# EAGLE schematic PIC32-HMZ144_Rev_B (EAGLE 4.16)
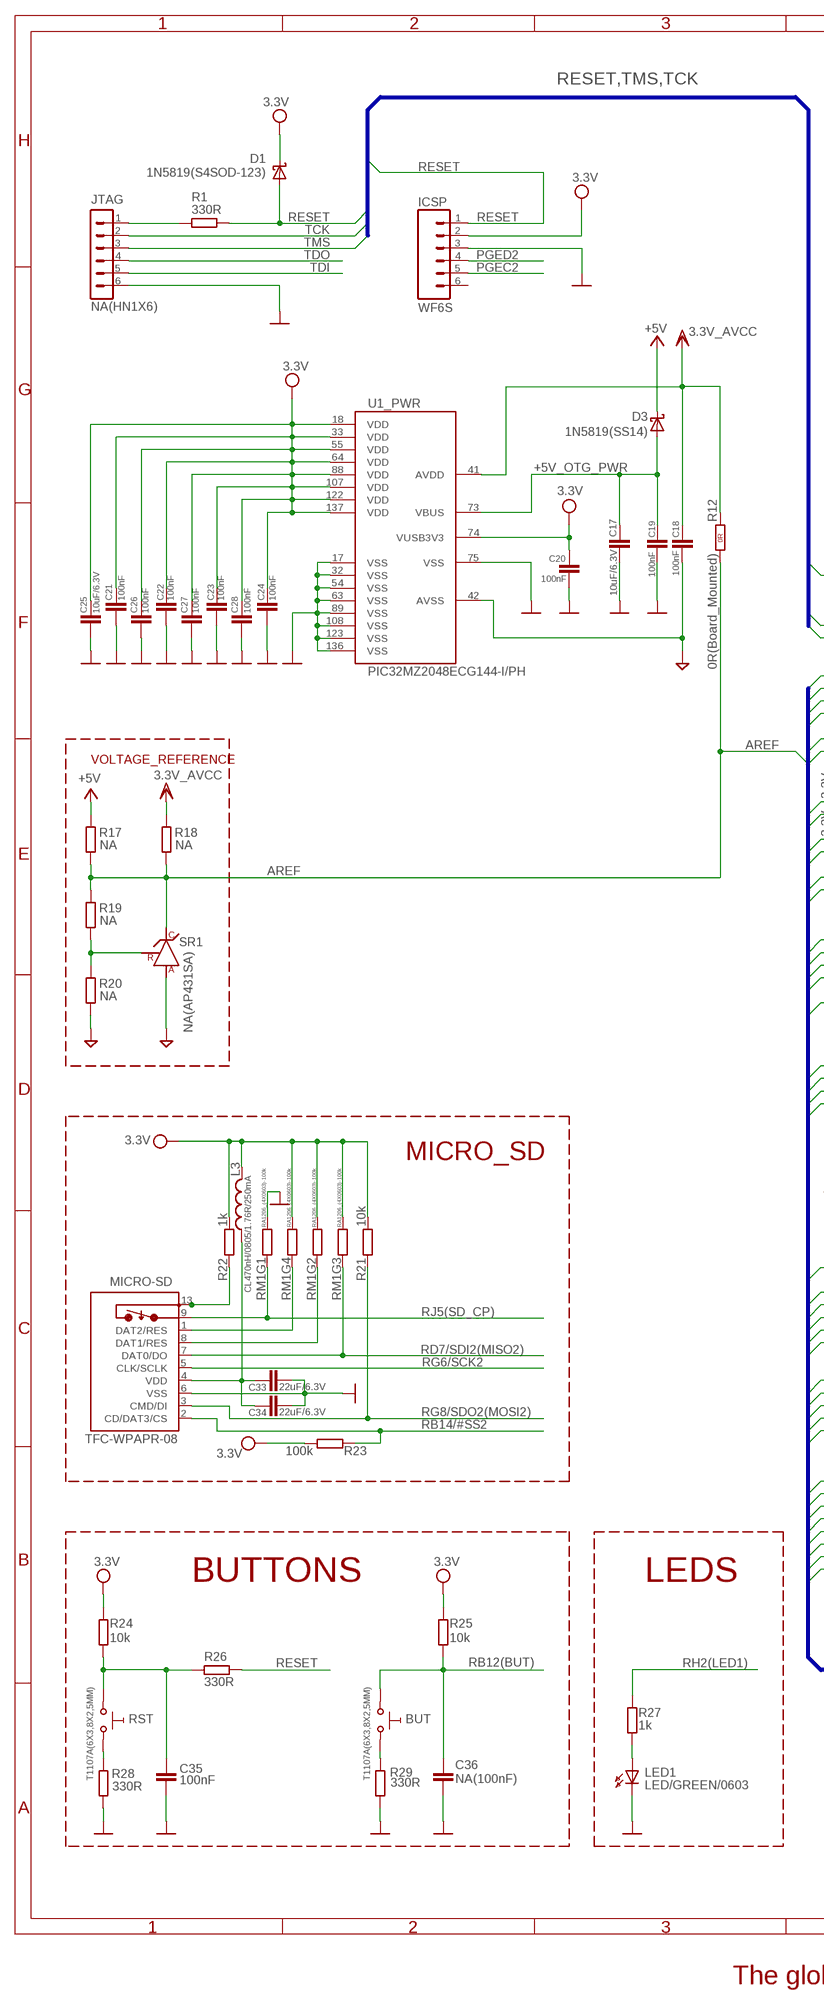
[diagram p0: schematic, sheet 1, part 1 of 2]
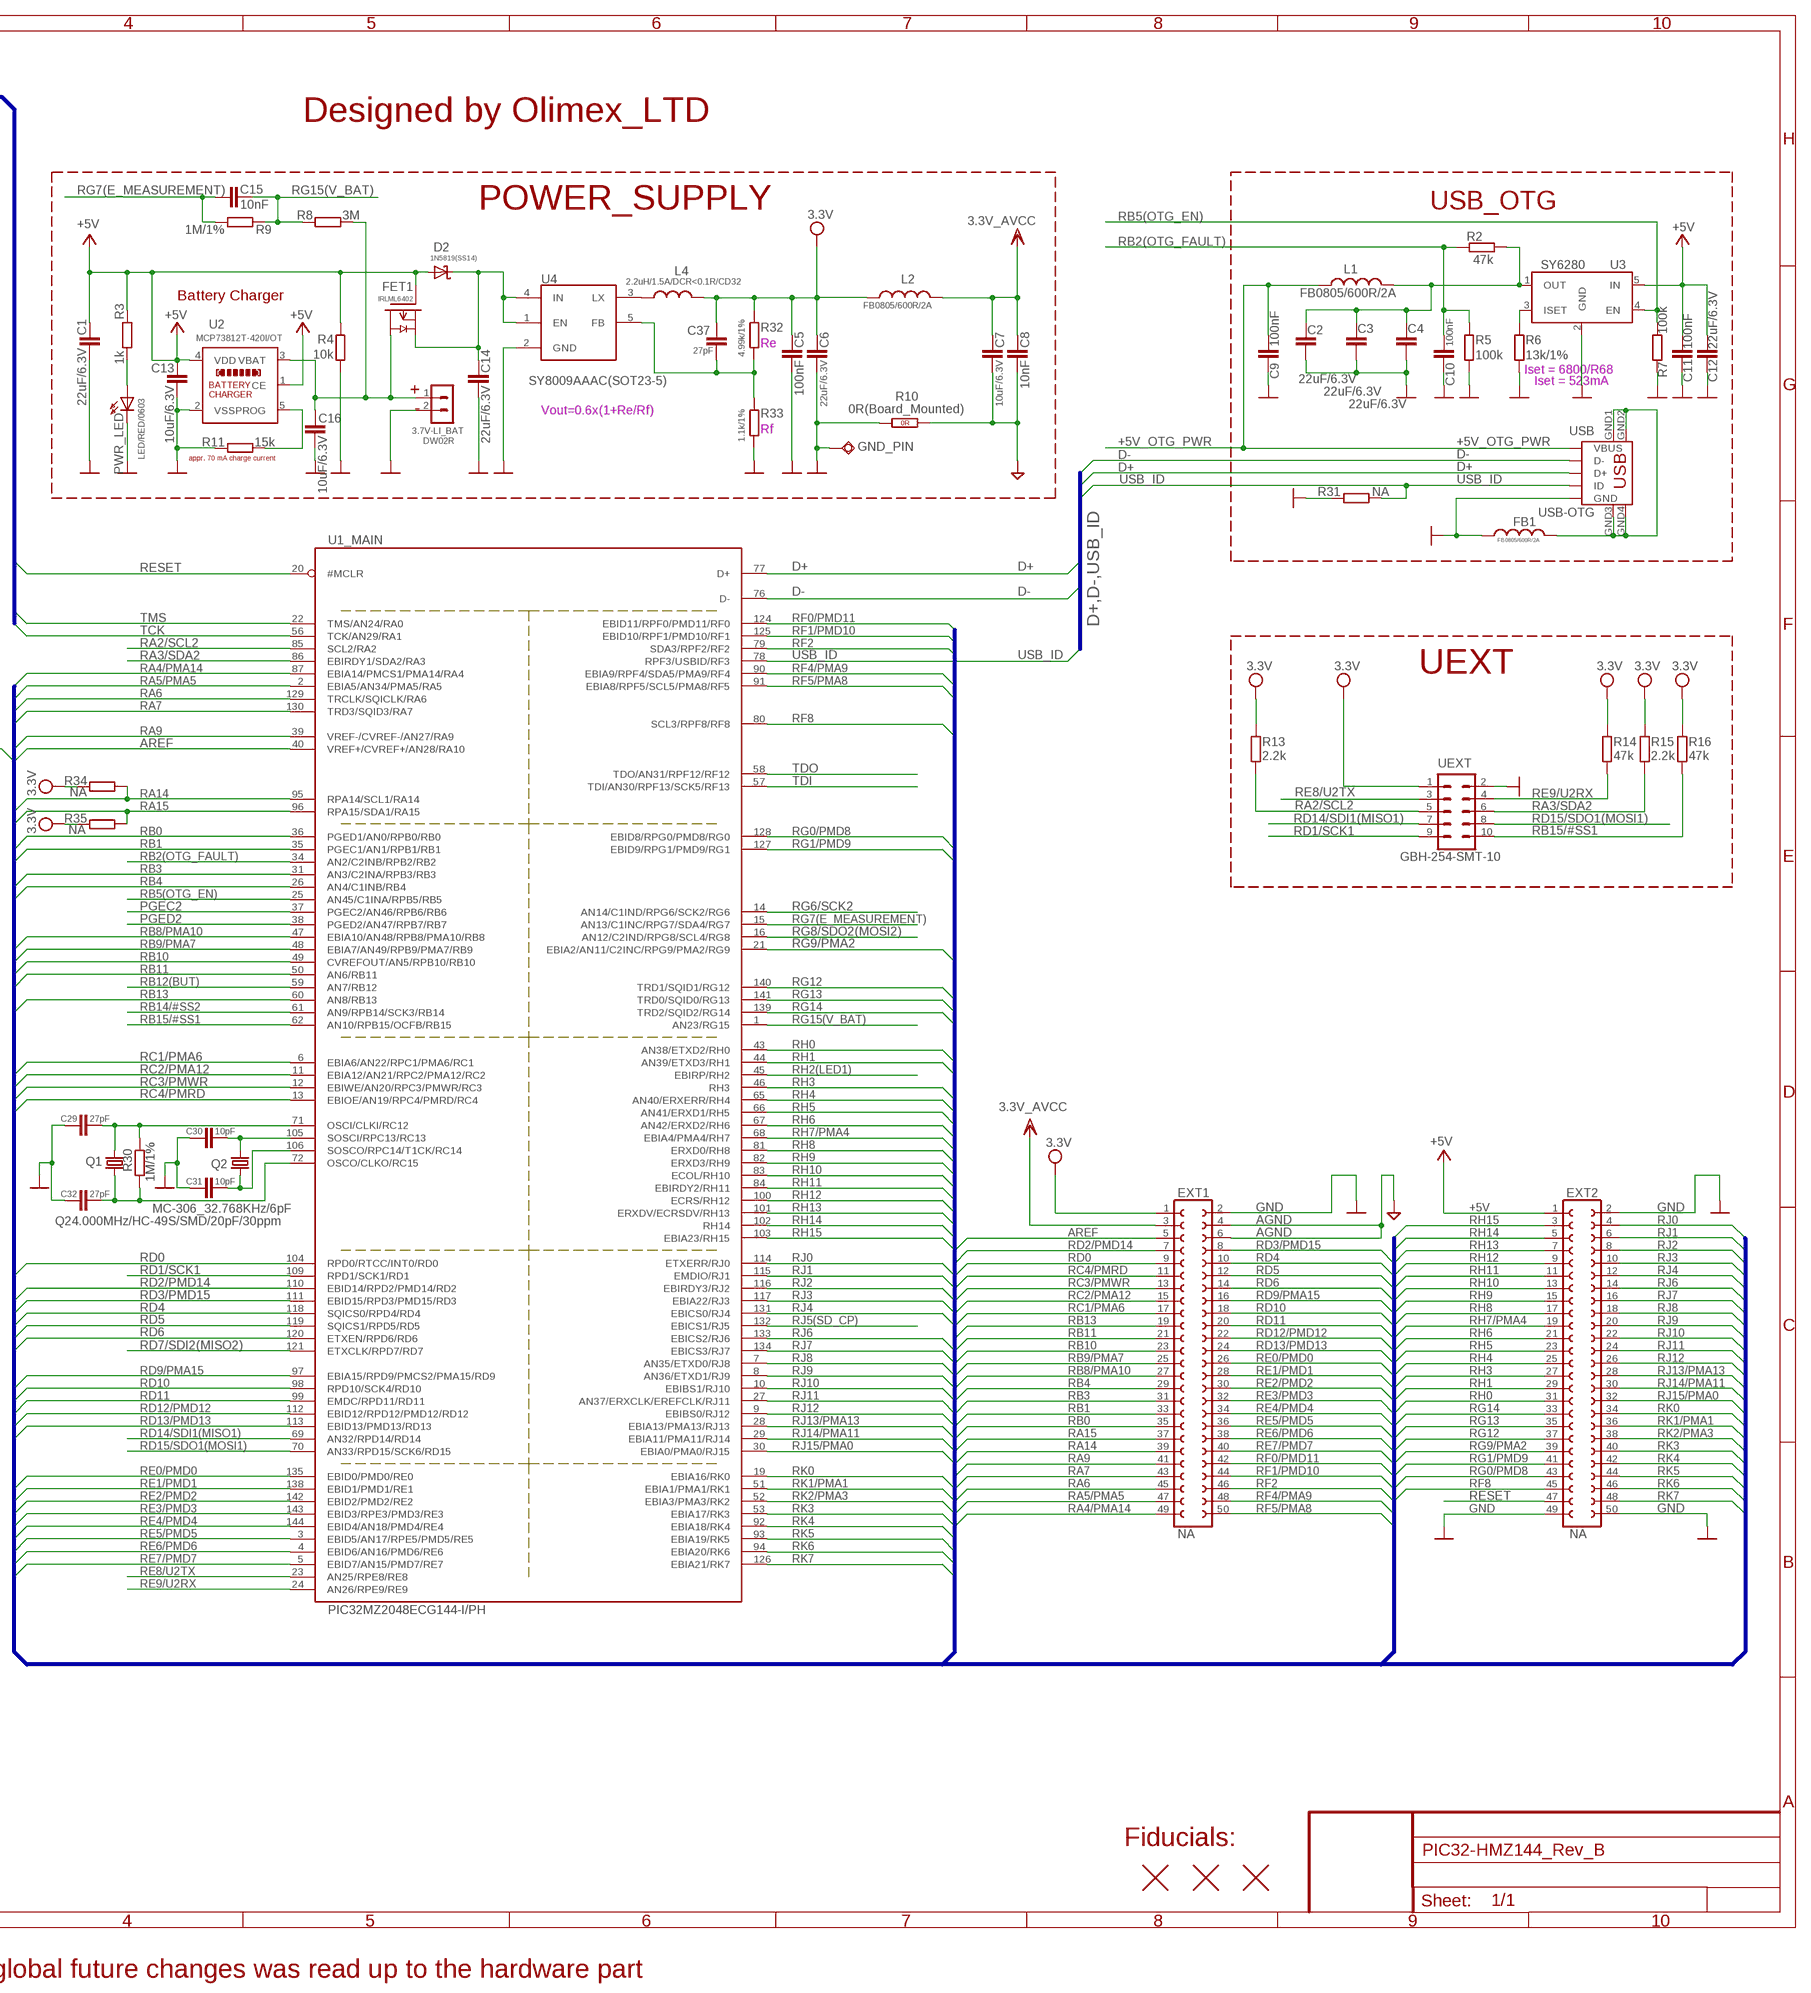
[diagram p1: schematic, sheet 1, part 2 of 2]

## Parts
3.7V-LI_BAT  DW02R  CON2DW02R  [DW02R]
BUT  T1107A(6X3,8X2,5MM)  SW-TAKTT1107A(6X3,8X2,5MM)  [WS-TAKT_6X3.5_SMD_NOCREAM]
C1  22uF/6.3V  C-EUC0603  [C0603]
C2  22uF/6.3V  C-EUC0603  [C0603]
C3  22uF/6.3V  C-EUC0603  [C0603]
C4  22uF/6.3V  C-EUC0603  [C0603]
C5  100nF  C-EUC0603  [C0603]
C6  22uF/6.3V  C-EUC0603  [C0603]
C7  10uF/6.3V  C-EUC0603  [C0603]
C8  10nF  C-EUC0603  [C0603]
C9  100nF  C-EUC0603  [C0603]
C10  100nF  C-EUC0603  [C0603]
C11  100nF  C-EUC0603  [C0603]
C12  22uF/6.3V  C-EUC0603  [C0603]
C13  10uF/6.3V  C-EUC0603  [C0603]
C14  22uF/6.3V  C-EUC0603  [C0603]
C15  10nF  C-EUC0603  [C0603]
C16  10uF/6.3V  C-EUC0603  [C0603]
C17  10uF/6.3V  C-EUC0603  [C0603]
C18  100nF  C-EUC0603  [C0603]
C19  100nF  C-EUC0603  [C0603]
C20  100nF  C-EUC0603  [C0603]
C21  100nF  C-EUC0603  [C0603]
C22  100nF  C-EUC0603  [C0603]
C23  100nF  C-EUC0603  [C0603]
C24  100nF  C-EUC0603  [C0603]
C25  10uF/6.3V  C-EUC0603  [C0603]
C26  100nF  C-EUC0603  [C0603]
C27  100nF  C-EUC0603  [C0603]
C28  100nF  C-EUC0603  [C0603]
C29  27pF  C-EUC0603  [C0603]
C30  10pF  C-EUC0603  [C0603]
C31  10pF  C-EUC0603  [C0603]
C32  27pF  C-EUC0603  [C0603]
C33  22uF/6.3V  C-EUC0603  [C0603]
C34  22uF/6.3V  C-EUC0603  [C0603]
C35  100nF  C-EUC0603  [C0603]
C36  NA(100nF)  C-EUC0603  [C0603]
C37  27pF  C-EUC0603  [C0603]
D1  1N5819(S4SOD-123)  SCHOTKKY7.62SS-1N5819(S4SOD-123)  [SOD-123]
D2  1N5819(SS14)  SCHOTKKY7.62SS2  [MLL-41]
D3  1N5819(SS14)  SCHOTKKY7.62SS2  [MLL-41]
EXT1  NA  FE25-2FEMALE  [FE25-2]
EXT2  NA  FE25-2FEMALE  [FE25-2]
FB1  FB0805/600R/2A  L-USL0805_5MIL_DWS  [L0805_5MIL_DWS]
FET1  IRLML6402  [SOT23]
GND_PIN  TESTPAD3  [TEST_PAD40/70/SQUARE]
ICSP  WF6S  CON62.54-0-D  [CON2.54MM-6-0D]
JTAG  NA(HN1X6)  CON6HN1X6  [HN1X6]
L1  FB0805/600R/2A  L-USL0805_5MIL_DWS  [L0805_5MIL_DWS]
L2  FB0805/600R/2A  L-USL0805_5MIL_DWS  [L0805_5MIL_DWS]
L3  CL470nH/0805/1.76R/250mA  L-USL0805  [L0805]
L4  2.2uH/1.5A/DCR<0.1R/CD32  L-CD32  [CD32]
LED1  LED/GREEN/0603  LED0603DWS  [LED-0603]
MICRO-SD  TFC-WPAPR-08  MICRO_SD/MMC_CP_NEWTFC-WPAPR-08  [TFC-WPAPR-08]
PWR_LED  LED/RED/0603  LED0603DWS  [LED-0603]
Q1  Q24.000MHz/HC-49S/SMD/20pF/30ppm  HC49/SHC49/SMD_THIN&SHORT  [HC49/SMD2_THIN&SHORT]
Q2  MC-306_32.768KHz/6pF  MC-306_32.768KHZ/SMD_8038  [MC-306]
R1  330R  R-EU_R0603  [R0603]
R2  47k  R-EU_R0603  [R0603]
R3  1k  R-EU_R0603  [R0603]
R4  10k  R-EU_R0603  [R0603]
R5  100k  R-EU_R0603  [R0603]
R6  13k/1%  R-EU_R0603  [R0603]
R7  100k  R-EU_R0603  [R0603]
R8  3M  R-EU_R0603  [R0603]
R9  1M/1%  R-EU_R0603  [R0603]
R10  0R(Board_Mounted)  R_0R0R(NA)  [0603_0R]
R11  15k  R-EU_R0603  [R0603]
R12  0R(Board_Mounted)  R_0R0R(NA)  [0603_0R]
R13  2.2k  R-EU_R0603  [R0603]
R14  47k  R-EU_R0603  [R0603]
R15  2.2k  R-EU_R0603  [R0603]
R16  47k  R-EU_R0603  [R0603]
R17  NA  R-EU_R0603  [R0603]
R18  NA  R-EU_R0603  [R0603]
R19  NA  R-EU_R0603  [R0603]
R20  NA  R-EU_R0603  [R0603]
R21  10k  R-EU_R0603  [R0603]
R22  1k  R-EU_R0603  [R0603]
R23  100k  R-EU_R0603  [R0603]
R24  10k  R-EU_R0603  [R0603]
R25  10k  R-EU_R0603  [R0603]
R26  330R  R-EU_R0603  [R0603]
R27  1k  R-EU_R0603  [R0603]
R28  330R  R-EU_R0603  [R0603]
R29  330R  R-EU_R0603  [R0603]
R30  1M/1%  R-EU_R0603  [R0603]
R31  NA  R-EU_R0603  [R0603]
R32  4.99k/1%  R-EU_R0603_5MIL_DWS  [R0603_5MIL_DWS]
R33  1.1k/1%  R-EU_R0603_5MIL_DWS  [R0603_5MIL_DWS]
R34  NA  R-EU_R0603  [R0603]
R35  NA  R-EU_R0603  [R0603]
RM1  RA1206_(4X0603)-100k  R_MATRIX_4E  [R_MATRIX_4]
RST  T1107A(6X3,8X2,5MM)  SW-TAKTT1107A(6X3,8X2,5MM)  [WS-TAKT_6X3.5_SMD_NOCREAM]
SR1  NA(AP431SA)  TL431'''  [SOT-23]
U1  PIC32MZ2048ECG144-I/PH  [TQFP144]
U2  MCP73812T-420I/OT  MCP7381XSOT-23-5  [SOT-23-5]
U3  SY6280  [SOT23-5]
U4  SY8009AAAC(SOT23-5)  SY8008  [SOT23-5]
U$1  FIDUCIAL  [FIDUCIAL-1X3]
U$2  FIDUCIAL  [FIDUCIAL-1X3]
U$3  FIDUCIAL  [FIDUCIAL-1X3]
UEXT  GBH-254-SMT-10  ML10MD  [ML10_S]
USB  USB-OTG  MINI_USB9  [USB_MINI_9PIN]

## Nets
+5V: C1.1 C11.1 C12.1 C13.1 D2.A D3.K(C) EXT2.1 FET1.1(G) R3.1 R4.1 R17.2 U2.1(CE) U2.4(VDD) U3.5(IN)
+5V_OTG_PWR [pwr]: C9.1 C17.1 C19.2 D3.A L1.1 U1.73(_PWR:VBUS) USB.VBUS
AGND: C7.2 C8.2 C18.2 EXT1.4 EXT1.6 R10.2(1.2) R20.1 SR1.3(A) U1.42(_PWR:AVSS)
AREF: EXT1.5 R12.2(1.2) R17.1 R18.1 R19.2 SR1.1(C) U1.40(_MAIN:VREF+/CVREF+/AN28/RA10)
D+: U1.77(_MAIN:D+) USB.D+
D-: U1.76(_MAIN:D-) USB.D-
DCDC_IN: C14.1 D2.K(C) FET1.2(S) U4.1(EN) U4.4(IN)
GND [pwr]: 3.7V-LI_BAT.2 C1.2 C2.2 C3.2 C4.2 C5.2 C6.2 C9.2 C10.2 C11.2 C12.2 C13.2 C14.2 C16.2 C17.2 C19.1 C20.1 C21.2 C22.2 C23.2 C24.2 C25.2 C26.2 C27.2 C28.2 C29.1 C30.1 C31.1 C32.1 C33.2 C34.2 C35.2 C36.2 EXT1.2 EXT2.2 EXT2.49 EXT2.50 FB1.1 GND_PIN.P$1(PP) ICSP.3 JTAG.6 LED1.C MICRO-SD.6(VSS) PWR_LED.C R4.2 R5.1 R6.1 R7.1 R10.1(1.1) R11.1 R28.1 R29.1 R31.1 R33.2 RM1.1.2 U1.17(_PWR:VSS) U1.32(_PWR:VSS) U1.54(_PWR:VSS) U1.63(_PWR:VSS) U1.75(_PWR:VSS) U1.89(_PWR:VSS) U1.108(_PWR:VSS) U1.123(_PWR:VSS) U1.136(_PWR:VSS) U2.2(VSS) U3.2(GND) U4.2(GND) UEXT.2 USB.GND
MCIDAT1: MICRO-SD.8(DAT1/RES) RM1.2.1
MCIDAT2: MICRO-SD.1(DAT2/RES) RM1.4.1
N$1: C35.1 R24.2 R26.1 RST.P$1
N$2: JTAG.1 R1.1
N$4: MICRO-SD.10(PACK1) MICRO-SD.11(PACK2) MICRO-SD.12(PACK3) MICRO-SD.13(PACK4) R22.1
N$8: PWR_LED.A R3.2
N$11 [pwr]: R28.2 RST.P$2
N$12 [pwr]: BUT.P$2 R29.2
N$17: C29.2 Q1.2 R30.2 U1.71(_MAIN:OSCI/CLKI/RC12)
N$19: C32.2 Q1.1 R30.1 U1.72(_MAIN:OSCO/CLKO/RC15)
N$20: C31.2 Q2.4 U1.106(_MAIN:SOSCO/RPC14/T1CK/RC14)
N$21: C30.2 Q2.1 U1.105(_MAIN:SOSCI/RPC13/RC13)
N$22: R11.2 U2.5(PROG)
N$23: LED1.A R27.1
N$36: R19.1 R20.2 SR1.2(R)
N$64: L4.1 U4.3(LX)
N$66: C37.2 R32.2 R33.1 U4.5(FB)
N$115: R6.2 U3.3(ISET)
N$116: C33.1 C34.1 L3.2 MICRO-SD.4(VDD)
N$137: C2.1 C3.1 C4.1 L1.2 R2.2 U3.1(OUT)
PGEC2: ICSP.5 U1.37(_MAIN:PGEC2/AN46/RPB6/RB6)
PGED2: ICSP.4 U1.38(_MAIN:PGED2/AN47/RPB7/RB7)
RA2/SCL2: R13.1 U1.85(_MAIN:SCL2/RA2) UEXT.5
RA3/SDA2: R15.1 U1.86(_MAIN:EBIRDY1/SDA2/RA3) UEXT.6
RA4/PMA14: EXT1.49 U1.87(_MAIN:EBIA14/PMCS1/PMA14/RA4)
RA5/PMA5: EXT1.47 U1.2(_MAIN:EBIA5/AN34/PMA5/RA5)
RA6: EXT1.45 U1.129(_MAIN:TRCLK/SQICLK/RA6)
RA7: EXT1.43 U1.130(_MAIN:TRD3/SQID3/RA7)
RA9: EXT1.41 U1.39(_MAIN:VREF-/CVREF-/AN27/RA9)
RA14: EXT1.39 R34.2 U1.95(_MAIN:RPA14/SCL1/RA14)
RA15: EXT1.37 R35.2 U1.96(_MAIN:RPA15/SDA1/RA15)
RB0: EXT1.35 U1.36(_MAIN:PGED1/AN0/RPB0/RB0)
RB1: EXT1.33 U1.35(_MAIN:PGEC1/AN1/RPB1/RB1)
RB2(OTG_FAULT): C10.1 R2.1 R5.2 U1.34(_MAIN:AN2/C2INB/RPB2/RB2)
RB3: EXT1.31 U1.31(_MAIN:AN3/C2INA/RPB3/RB3)
RB4: EXT1.29 U1.26(_MAIN:AN4/C1INB/RB4)
RB5(OTG_EN): R7.2 U1.25(_MAIN:AN45/C1INA/RPB5/RB5) U3.4(EN)
RB8/PMA10: EXT1.27 U1.47(_MAIN:EBIA10/AN48/RPB8/PMA10/RB8)
RB9/PMA7: EXT1.25 U1.48(_MAIN:EBIA7/AN49/RPB9/PMA7/RB9)
RB10: EXT1.23 U1.49(_MAIN:CVREFOUT/AN5/RPB10/RB10)
RB11: EXT1.21 U1.50(_MAIN:AN6/RB11)
RB12(BUT): BUT.P$1 C36.1 R25.2 U1.59(_MAIN:AN7/RB12)
RB13: EXT1.19 U1.60(_MAIN:AN8/RB13)
RB14/#SS2: MICRO-SD.2(CD/DAT3/CS) R23.1 U1.61(_MAIN:AN9/RPB14/SCK3/RB14)
RB15/#SS1: R16.1 U1.62(_MAIN:AN10/RPB15/OCFB/RB15) UEXT.10
RC1/PMA6: EXT1.17 U1.6(_MAIN:EBIA6/AN22/RPC1/PMA6/RC1)
RC2/PMA12: EXT1.15 U1.11(_MAIN:EBIA12/AN21/RPC2/PMA12/RC2)
RC3/PMWR: EXT1.13 U1.12(_MAIN:EBIWE/AN20/RPC3/PMWR/RC3)
RC4/PMRD: EXT1.11 U1.13(_MAIN:EBIOE/AN19/RPC4/PMRD/RC4)
RD0: EXT1.9 U1.104(_MAIN:RPD0/RTCC/INT0/RD0)
RD1/SCK1: U1.109(_MAIN:RPD1/SCK1/RD1) UEXT.9
RD2/PMD14: EXT1.7 U1.110(_MAIN:EBID14/RPD2/PMD14/RD2)
RD3/PMD15: EXT1.8 U1.111(_MAIN:EBID15/RPD3/PMD15/RD3)
RD4: EXT1.10 U1.118(_MAIN:SQICS0/RPD4/RD4)
RD5: EXT1.12 U1.119(_MAIN:SQICS1/RPD5/RD5)
RD6: EXT1.14 U1.120(_MAIN:ETXEN/RPD6/RD6)
RD7/SDI2(MISO2): MICRO-SD.7(DAT0/DO) RM1.3.1 U1.121(_MAIN:ETXCLK/RPD7/RD7)
RD9/PMA15: EXT1.16 U1.97(_MAIN:EBIA15/RPD9/PMCS2/PMA15/RD9)
RD10: EXT1.18 U1.98(_MAIN:RPD10/SCK4/RD10)
RD11: EXT1.20 U1.99(_MAIN:EMDC/RPD11/RD11)
RD12/PMD12: EXT1.22 U1.112(_MAIN:EBID12/RPD12/PMD12/RD12)
RD13/PMD13: EXT1.24 U1.113(_MAIN:EBID13/PMD13/RD13)
RD14/SDI1(MISO1): U1.69(_MAIN:AN32/RPD14/RD14) UEXT.7
RD15/SDO1(MOSI1): U1.70(_MAIN:AN33/RPD15/SCK6/RD15) UEXT.8
RE0/PMD0: EXT1.26 U1.135(_MAIN:EBID0/PMD0/RE0)
RE1/PMD1: EXT1.28 U1.138(_MAIN:EBID1/PMD1/RE1)
RE2/PMD2: EXT1.30 U1.142(_MAIN:EBID2/PMD2/RE2)
RE3/PMD3: EXT1.32 U1.143(_MAIN:EBID3/RPE3/PMD3/RE3)
RE4/PMD4: EXT1.34 U1.144(_MAIN:EBID4/AN18/PMD4/RE4)
RE5/PMD5: EXT1.36 U1.3(_MAIN:EBID5/AN17/RPE5/PMD5/RE5)
RE6/PMD6: EXT1.38 U1.4(_MAIN:EBID6/AN16/PMD6/RE6)
RE7/PMD7: EXT1.40 U1.5(_MAIN:EBID7/AN15/PMD7/RE7)
RE8/U2TX: U1.23(_MAIN:AN25/RPE8/RE8) UEXT.3
RE9/U2RX: R14.1 U1.24(_MAIN:AN26/RPE9/RE9) UEXT.4
RESET: D1.A EXT2.47 ICSP.1 R1.2 R26.2 U1.20(_MAIN:#MCLR)
RF0/PMD11: EXT1.42 U1.124(_MAIN:EBID11/RPF0/PMD11/RF0)
RF1/PMD10: EXT1.44 U1.125(_MAIN:EBID10/RPF1/PMD10/RF1)
RF2: EXT1.46 U1.79(_MAIN:SDA3/RPF2/RF2)
RF4/PMA9: EXT1.48 U1.90(_MAIN:EBIA9/RPF4/SDA5/PMA9/RF4)
RF5/PMA8: EXT1.50 U1.91(_MAIN:EBIA8/RPF5/SCL5/PMA8/RF5)
RF8: EXT2.45 U1.80(_MAIN:SCL3/RPF8/RF8)
RG0/PMD8: EXT2.43 U1.128(_MAIN:EBID8/RPG0/PMD8/RG0)
RG1/PMD9: EXT2.41 U1.127(_MAIN:EBID9/RPG1/PMD9/RG1)
RG6/SCK2: MICRO-SD.5(CLK/SCLK) U1.14(_MAIN:AN14/C1IND/RPG6/SCK2/RG6)
RG7(E_MEASUREMENT): C15.2 R9.1 U1.15(_MAIN:AN13/C1INC/RPG7/SDA4/RG7)
RG8/SDO2(MOSI2): MICRO-SD.3(CMD/DI) R21.1 U1.16(_MAIN:AN12/C2IND/RPG8/SCL4/RG8)
RG9/PMA2: EXT2.39 U1.21(_MAIN:EBIA2/AN11/C2INC/RPG9/PMA2/RG9)
RG12: EXT2.37 U1.140(_MAIN:TRD1/SQID1/RG12)
RG13: EXT2.35 U1.141(_MAIN:TRD0/SQID0/RG13)
RG14: EXT2.33 U1.139(_MAIN:TRD2/SQID2/RG14)
RG15(V_BAT): C15.1 R8.2 R9.2 U1.1(_MAIN:AN23/RG15)
RH0: EXT2.31 U1.43(_MAIN:AN38/ETXD2/RH0)
RH1: EXT2.29 U1.44(_MAIN:AN39/ETXD3/RH1)
RH2(LED1): R27.2 U1.45(_MAIN:EBIRP/RH2)
RH3: EXT2.27 U1.46(_MAIN:RH3)
RH4: EXT2.25 U1.65(_MAIN:AN40/ERXERR/RH4)
RH5: EXT2.23 U1.66(_MAIN:AN41/ERXD1/RH5)
RH6: EXT2.21 U1.67(_MAIN:AN42/ERXD2/RH6)
RH7/PMA4: EXT2.19 U1.68(_MAIN:EBIA4/PMA4/RH7)
RH8: EXT2.17 U1.81(_MAIN:ERXD0/RH8)
RH9: EXT2.15 U1.82(_MAIN:ERXD3/RH9)
RH10: EXT2.13 U1.83(_MAIN:ECOL/RH10)
RH11: EXT2.11 U1.84(_MAIN:EBIRDY2/RH11)
RH12: EXT2.9 U1.100(_MAIN:ECRS/RH12)
RH13: EXT2.7 U1.101(_MAIN:ERXDV/ECRSDV/RH13)
RH14: EXT2.5 U1.102(_MAIN:RH14)
RH15: EXT2.3 U1.103(_MAIN:EBIA23/RH15)
RJ0: EXT2.4 U1.114(_MAIN:ETXERR/RJ0)
RJ1: EXT2.6 U1.115(_MAIN:EMDIO/RJ1)
RJ2: EXT2.8 U1.116(_MAIN:EBIRDY3/RJ2)
RJ3: EXT2.10 U1.117(_MAIN:EBIA22/RJ3)
RJ4: EXT2.12 U1.131(_MAIN:EBICS0/RJ4)
RJ5(SD_CP): MICRO-SD.9(CP_E) RM1.1.1 U1.132(_MAIN:EBICS1/RJ5)
RJ6: EXT2.14 U1.133(_MAIN:EBICS2/RJ6)
RJ7: EXT2.16 U1.134(_MAIN:EBICS3/RJ7)
RJ8: EXT2.18 U1.7(_MAIN:AN35/ETXD0/RJ8)
RJ9: EXT2.20 U1.8(_MAIN:AN36/ETXD1/RJ9)
RJ10: EXT2.22 U1.10(_MAIN:EBIBS1/RJ10)
RJ11: EXT2.24 U1.27(_MAIN:AN37/ERXCLK/EREFCLK/RJ11)
RJ12: EXT2.26 U1.9(_MAIN:EBIBS0/RJ12)
RJ13/PMA13: EXT2.28 U1.28(_MAIN:EBIA13/PMA13/RJ13)
RJ14/PMA11: EXT2.30 U1.29(_MAIN:EBIA11/PMA11/RJ14)
RJ15/PMA0: EXT2.32 U1.30(_MAIN:EBIA0/PMA0/RJ15)
RK0: EXT2.34 U1.19(_MAIN:EBIA16/RK0)
RK1/PMA1: EXT2.36 U1.51(_MAIN:EBIA1/PMA1/RK1)
RK2/PMA3: EXT2.38 U1.52(_MAIN:EBIA3/PMA3/RK2)
RK3: EXT2.40 U1.53(_MAIN:EBIA17/RK3)
RK4: EXT2.42 U1.92(_MAIN:EBIA18/RK4)
RK5: EXT2.44 U1.93(_MAIN:EBIA19/RK5)
RK6: EXT2.46 U1.94(_MAIN:EBIA20/RK6)
RK7: EXT2.48 U1.126(_MAIN:EBIA21/RK7)
TCK: JTAG.2 U1.56(_MAIN:TCK/AN29/RA1)
TDI: JTAG.5 U1.57(_MAIN:TDI/AN30/RPF13/SCK5/RF13)
TDO: JTAG.4 U1.58(_MAIN:TDO/AN31/RPF12/RF12)
TMS: JTAG.3 U1.22(_MAIN:TMS/AN24/RA0)
USB_ID: R31.2 U1.78(_MAIN:RPF3/USBID/RF3) USB.ID
USB_SHIELD: FB1.2 USB.GND1 USB.GND2 USB.GND3 USB.GND4
VBAT_P: 3.7V-LI_BAT.1 C16.1 FET1.3(D) R8.1 U2.3(VBAT)
VCC: C5.1 C6.1 C20.2 C21.1 C22.1 C23.1 C24.1 C25.1 C26.1 C27.1 C28.1 C37.1 D1.C EXT1.1 ICSP.2 L2.1 L3.1 L4.2 R13.2 R14.2 R15.2 R16.2 R21.2 R22.2 R23.2 R24.1 R25.1 R32.1 R34.1 R35.1 RM1.2.2 RM1.3.2 RM1.4.2 U1.18(_PWR:VDD) U1.33(_PWR:VDD) U1.55(_PWR:VDD) U1.64(_PWR:VDD) U1.74(_PWR:VUSB3V3) U1.88(_PWR:VDD) U1.107(_PWR:VDD) U1.122(_PWR:VDD) U1.137(_PWR:VDD) UEXT.1 ; supply symbol labelled 3.3V
VDD: C7.1 C8.1 C18.1 EXT1.3 L2.2 R12.1(1.1) R18.2 U1.41(_PWR:AVDD) ; supply symbol labelled 3.3V_AVCC
Unconnected: ICSP.6

## Buses
D+,D-,USB_ID
RESET,TMS,TCK
AREF,RA4/PMA14,RA4/PMA14,RA6,RA7,RA9,RA14,RA15,RB[0..1],RB[3..4],RB8/PMA10,RB9/PMA7,RB[10..11],RB13,RC1/PMA6,RC2/PMA12,RC3/PMWR,RC4/PMRD,RD0,RD2/PMD14,RD3/PMD15,RD[4..6]

## Notes on the sheet
- Designed by Olimex_LTD
- POWER_SUPPLY | USB_OTG
- Battery Charger
- Re
- Iset = 6800/R68
- Iset = 523mA
- +
- -
- Vout=0.6x(1+Re/Rf)
- Rf
- appr. 70 mA charge current
- UEXT
- VOLTAGE_REFERENCE
- MICRO_SD
- BUTTONS | LEDS
- Fiducials:
- The global future changes was read up to the hardware part

## Library data of the parts
3.7V-LI_BAT = Penko:CON2
BUT RST = gogo:SW-TAKT
C1-C37 = rcl:C-EU: CAPACITOR, European symbol
D1-D3 = gogo:SCHOTKKY7.62SS
EXT1 EXT2 = OLIMEX_CONNECTORS:FE25-2: FEMALE HEADER
FB1 L1-L3 = rcl:L-US: INDUCTOR, American symbol
FET1 = gogo:IRLML6402
GND_PIN = gogo:TESTPAD: drill 40mils, diameter 70mils
ICSP = DOUBLE-SIDE:CON6: CONNECTORS - 6 PINS
JTAG = Penko:CON6: CONNECTORS - 6 PINS
L4 = OLIMEX_DISCRET:L
LED1 PWR_LED = DOUBLE-SIDE:LED
MICRO-SD = OLIMEX_CONNECTORS:MICRO_SD/MMC_CP_NEW
Q1 = crystal:HC49/S: CRYSTAL
Q2 = crystal:MC-306
R1-R9 R11 R13-R35 = rcl:R-EU_: RESISTOR, European symbol
R10 R12 = OLIMEX_DISCRET:R_0R
RM1 = OLIMEX_DISCRET:R_MATRIX_4E
SR1 = OLIMEX_IC:TL431: TL431 Programmable Shunt Regulator Features: -> Programmable Output Voltage to 36 Volts -> Low Dynamic Output Impedance 0.20 Typical -> Sink Current Capability of 1.0 to 100mA -> Equivalent Full-Range Temperature Coefficient of 50ppm/°C Typical -> Temperature Compensated For Operation Over Full Rated Operating Temperature Range -> Low Output Noise Voltage -> Fast Turn-on Response
U1 = OLIMEX_IC:PIC32MZ2048ECG144: PIC32MZ EC FAMILY WITHOUT CAN
U2 = OLIMEX_DISCRET:MCP7381X
U3 = OLIMEX_IC:SY6280
U4 = OLIMEX_IC:SY8008
U$1-U$3 = SparkFunEagle-6-6-07:FIDUCIAL: Fiducial Alignment Points Various fiducial points for machine vision alignment.
UEXT = con-harting-ml:ML10: HARTING
USB = OLIMEX_CONNECTORS:MINI_USB9